# EAGLE design IRController (EAGLE 7.7.0)
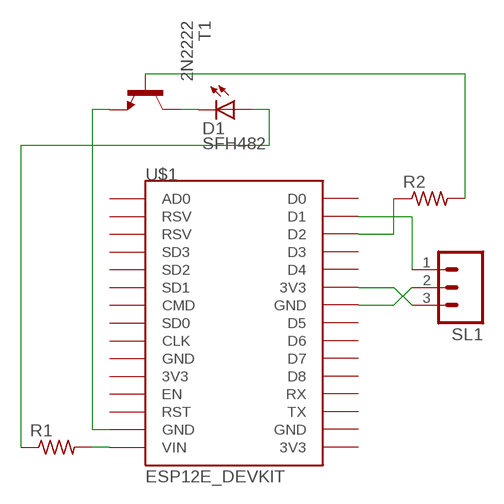
[diagram p0: schematic, sheet 1]

## Parts
D1  SFH482  [SFH482]
R1  R-US_0204/2V  [0204V]
R2  R-US_0204/2V  [0204V]
SL1  MA03  [03P]
T1  2N2222  [TO18]
U$1  ESP12E_DEVKIT  [ESP12E_DEVKIT]

## Nets
N$1: SL1.1 U$1.D1
N$2: SL1.3 U$1.3V3@1(3V3)
N$3: SL1.2 U$1.GND@2(GND)
N$4: R2.1 U$1.D2
N$5: R1.2 U$1.VIN
N$6: D1.A R1.1
N$7: R2.2 T1.2(B)
N$8: D1.K(C) T1.3(C)
N$9: T1.1(E) U$1.GND@1(GND)
Unconnected: U$1.3V3@0(3V3) U$1.3V3@2(3V3) U$1.AD0 U$1.CLK U$1.CMD U$1.D0 U$1.D3 U$1.D4 U$1.D5 U$1.D6 U$1.D7 U$1.D8 U$1.EN U$1.GND@0(GND) U$1.GND@3(GND) U$1.RST U$1.RSV@0(RSV) U$1.RSV@1(RSV) U$1.RX U$1.SD0 U$1.SD1 U$1.SD2 U$1.SD3 U$1.TX

## Library data of the parts
D1 = led:SFH482: IR LED infrared emitting diode, Infineon
R1 R2 = rcl:R-US_: RESISTOR, American symbol
SL1 = con-amp-quick:MA03: AMP QUICK CONNECTOR; OC_FARNELL: unknown; OC_NEWARK: unknown
T1 = transistor:2N2222: NPN TRANSISTOR
U$1 = ESP12E_DEVKIT:ESP12E_DEVKIT: ESP12E DEVKIT BOARD

## Board
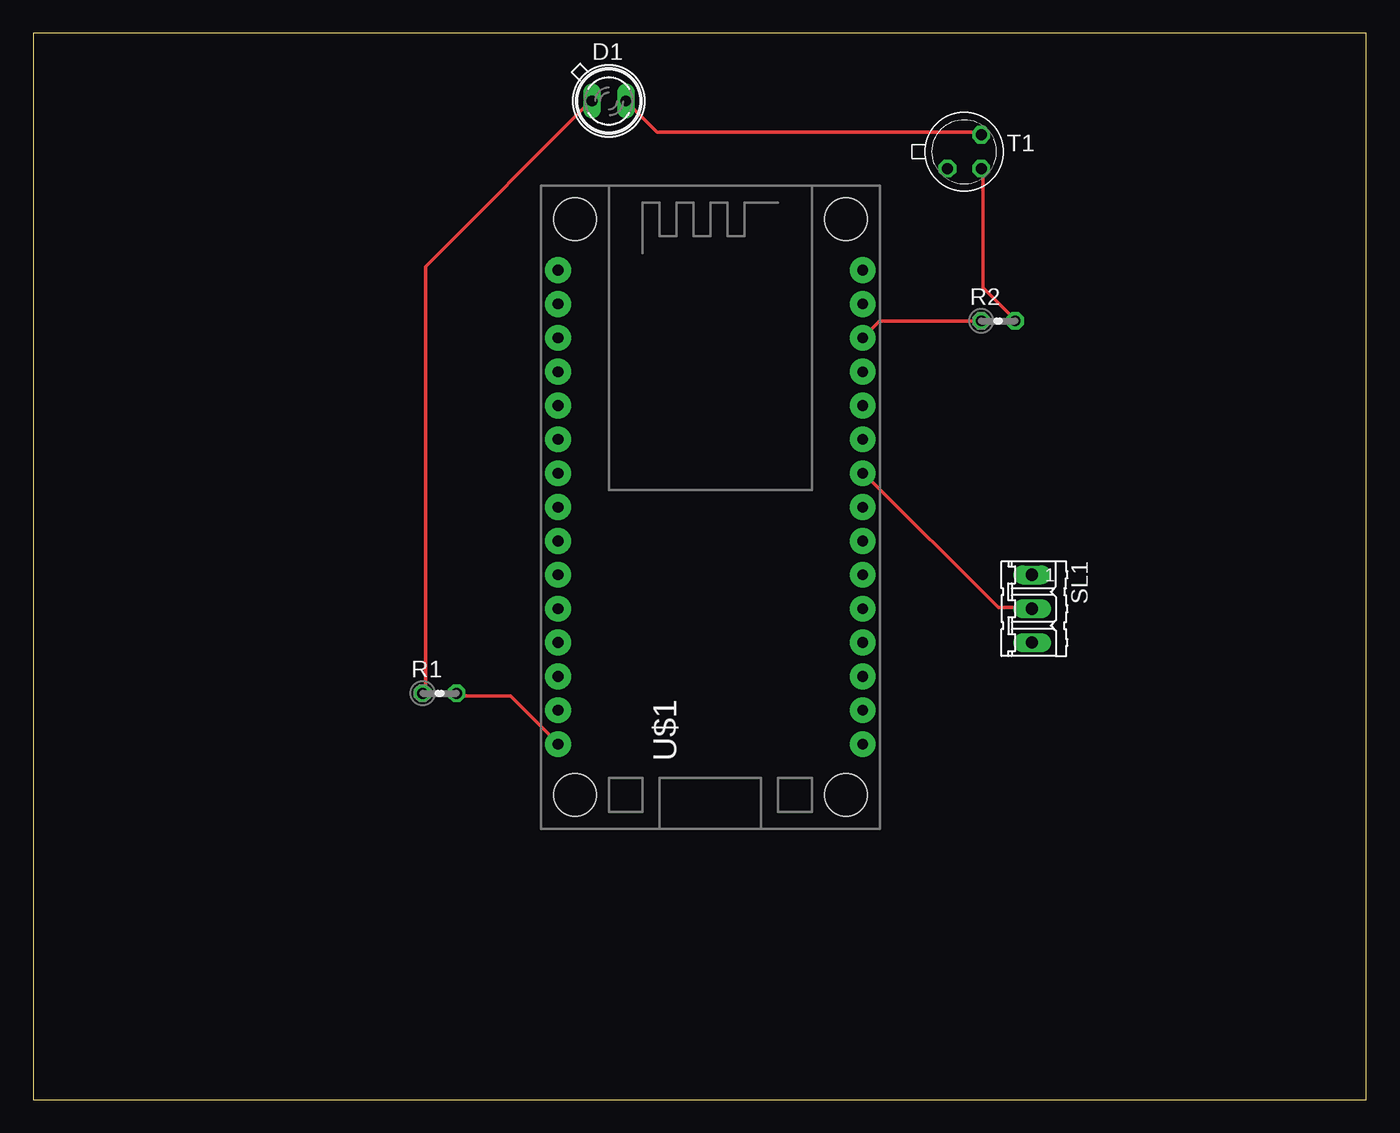
[diagram p1: board, top side]
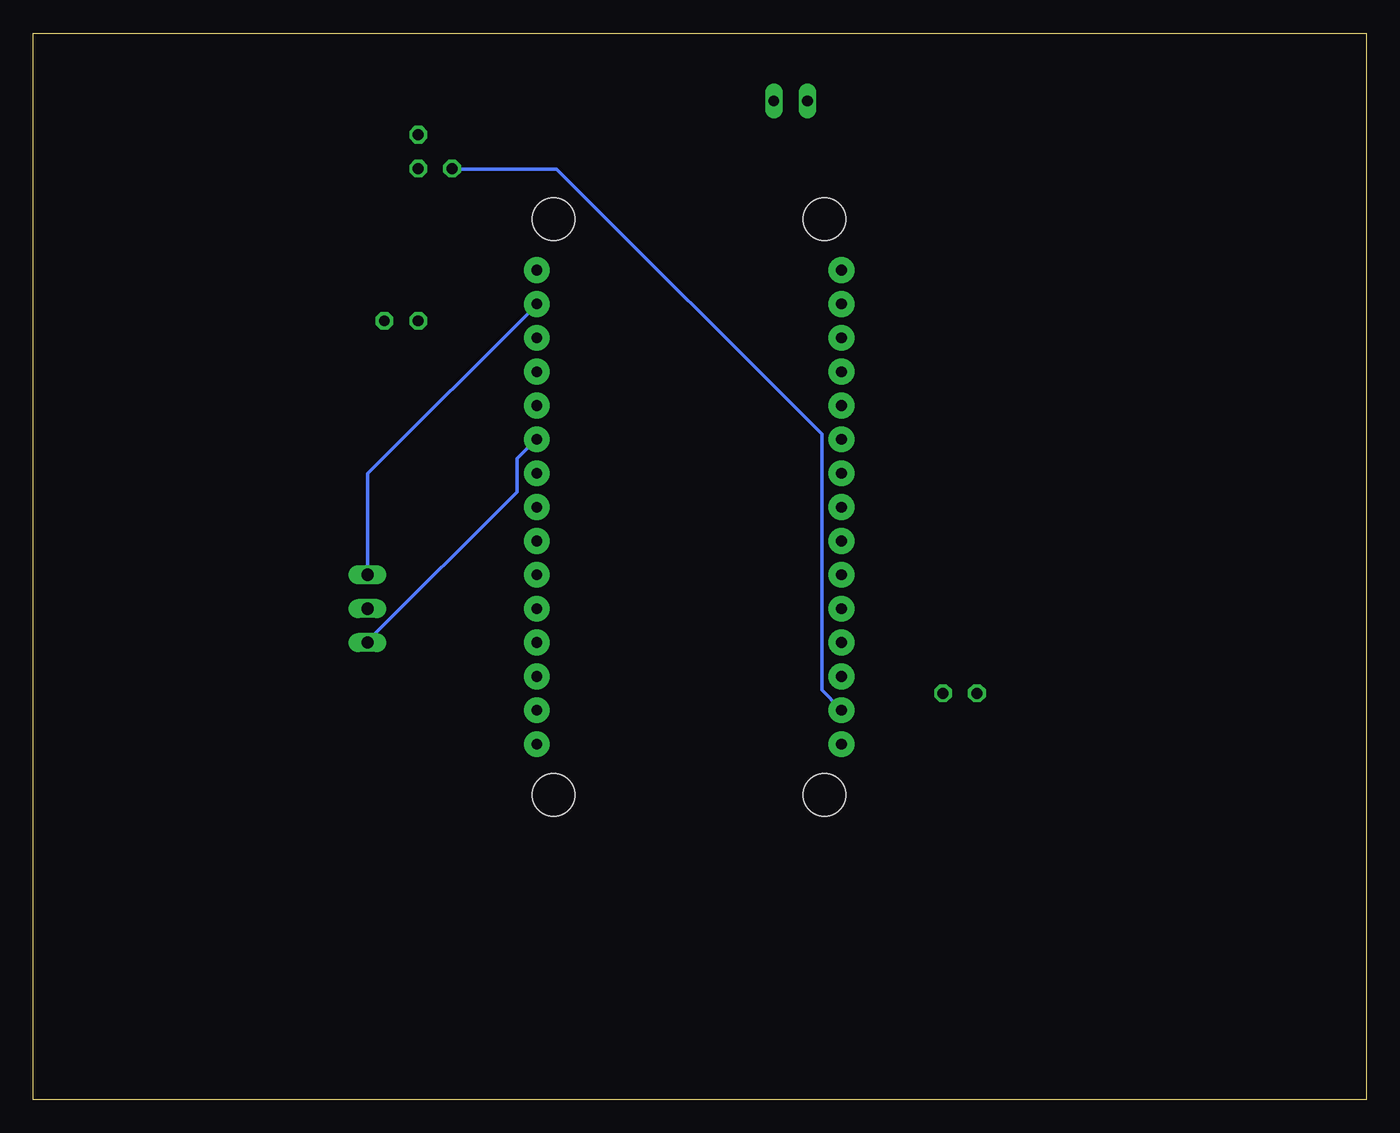
[diagram p2: board, bottom side, seen from below]

Size 100 x 80 mm. Coordinates in mm from the lower left corner, seen from the top.
Outline: 0,0 100,0 100,80 0,80 0,0
Copper layers (1*16): Top 0.035mm / dielectric 1.5mm / Bottom 0.035mm
Design rules "default": minimum track width 10mil, minimum drill 24mil, track to track 8mil, track to pad 8mil, pad to pad 8mil, via to via 8mil, smd to smd 8mil, copper to edge 40mil, drill to drill 8mil, minimum pad ring 10mil, minimum via ring 8mil, stop-mask expansion 4mil, vias tented up to drill 0mil, thermal gap 10mil

### Footprints (pad centres in the part's own frame; a part is rotated, then mirrored left to right if it is on the bottom)
SFH482 = drill 0.813 long: A -1.27,0; K 1.27,0
0204V = drill 0.813 octagon: 1 -1.27,0; 2 1.27,0
03P = drill 0.914 long: 1 -2.54,0; 2 0,0; 3 2.54,0
TO18 = drill 0.813 octagon: 1 -1.27,-1.27; 2 1.27,-1.27; 3 1.27,1.27
ESP12E_DEVKIT = drill 0.8 pad 1.93: 3V3@0 -11.43,-7.62; 3V3@1 11.43,5.08; 3V3@2 11.43,-17.78; AD0 -11.43,17.78; CLK -11.43,-2.54; CMD -11.43,2.54; D0 11.43,17.78; D1 11.43,15.24; D2 11.43,12.7; D3 11.43,10.16; D4 11.43,7.62; D5 11.43,0; D6 11.43,-2.54; D7 11.43,-5.08; D8 11.43,-7.62; EN -11.43,-10.16; GND@0 -11.43,-5.08; GND@1 -11.43,-15.24; GND@2 11.43,2.54; GND@3 11.43,-15.24; RST -11.43,-12.7; RSV@0 -11.43,15.24; RSV@1 -11.43,12.7; RX 11.43,-10.16; SD0 -11.43,0; SD1 -11.43,5.08; SD2 -11.43,7.62; SD3 -11.43,10.16; TX 11.43,-12.7; VIN -11.43,-17.78 | hole 3.2: -10.16,21.59; 10.16,21.59; 10.16,-21.59; -10.16,-21.59

### Placement (x,y rotation side)
D1  43.18,74.93 0 top
R1  30.48,30.48 0 top
R2  72.39,58.42 0 top
SL1  74.93,36.83 270 top
T1  69.85,71.12 0 top
U$1  50.8,44.45 0 top

### Tracks (layer width: path | path; a pad name or v marks a point on that pad's centre or on a via)
N$1
  Bottom 0.254: SL1.1 74.91,39.42 74.91,46.97 62.33,59.54 U$1.D1
N$2
  Bottom 0.254: SL1.3 74.91,34.39 63.7,45.59 63.7,48.11 62.33,49.48 U$1.3V3@1
N$3
  Top 0.254: SL1.2 74.91,36.91 72.39,36.91 62.33,46.97 U$1.GND@2
N$4
  Top 0.254: U$1.D2 63.48,58.4 71.02,58.4 R2.1
N$5
  Top 0.254: R1.2 31.93,30.28 35.81,30.28 39.24,26.85 U$1.VIN
N$6
  Top 0.254: R1.1 29.41,30.5 29.41,62.51 41.76,74.85 D1.A
N$7
  Top 0.254: T1.2 71.25,69.83 71.25,60.91 73.53,58.62 R2.2
N$8
  Top 0.254: T1.3 71.02,72.57 46.79,72.57 44.5,74.85 D1.K
N$9
  Bottom 0.254: T1.1 68.5,69.83 60.73,69.83 40.84,49.94 40.84,30.73 39.47,29.36 U$1.GND@1